# EAGLE design USBGpib (EAGLE 6.6.0)
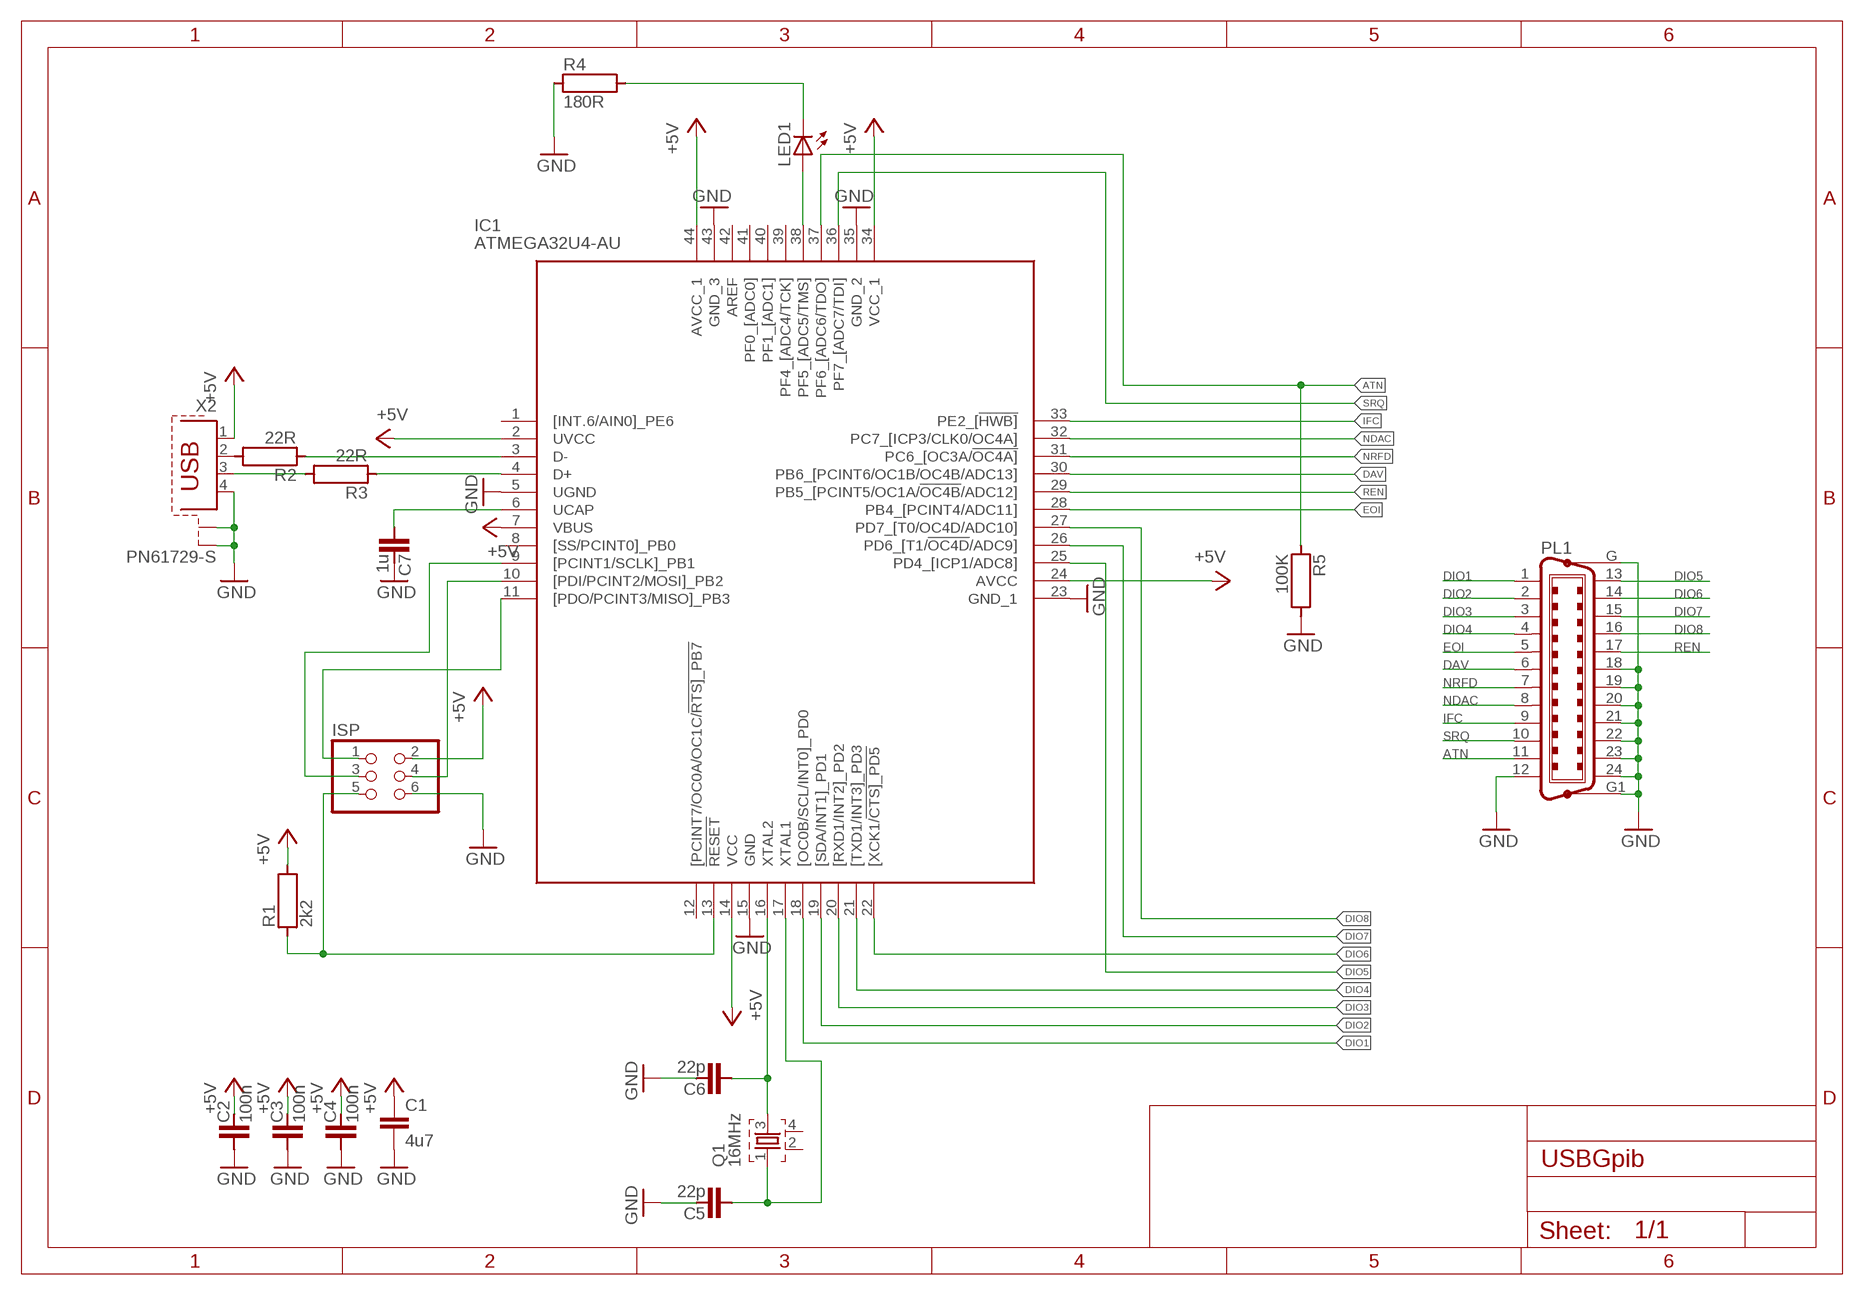
[diagram p0: schematic, sheet 1]

## Parts
C1  4u7  C-EUC1210  [C1210]
C2  100n  C0402  [C0402]
C3  100n  C0402  [C0402]
C4  100n  C0402  [C0402]
C5  22p  C0402  [C0402]
C6  22p  C0402  [C0402]
C7  1u  C0603  [C0603]
IC1  ATMEGA32U4-AU  ATMEGA16U4-AU  [QFP80P1200X1200X120-44N]
ISP  PINHD-2X3  [2X03]
LED1  LEDCHIPLED_1206  [CHIPLED_1206]
PL1  C24HPMALE  [24HP_MALE]
Q1  16MHz  FA-20H  [FA-20H]
R1  2k2  R0402  [R0402]
R2  22R  R0402  [R0402]
R3  22R  R0402  [R0402]
R4  180R  R0402  [R0402]
R5  100K  R0402  [R0402]
X2  PN61729-S  [PN61729-S]

## Nets
+5V: C1.1 C2.2 C3.2 C4.2 IC1.2(UVCC) IC1.7(VBUS) IC1.14(VCC) IC1.24(AVCC) IC1.34(VCC_1) IC1.44(AVCC_1) ISP.2 R1.2 X2.1
ATN: IC1.37(PF6_[ADC6/TDO]) PL1.11 R5.1
DAV: IC1.30(PB6_[PCINT6/OC1B/OC4B/ADC13]) PL1.6
DIO1: IC1.18([OC0B/SCL/INT0]_PD0) PL1.1
DIO2: IC1.19([SDA/INT1]_PD1) PL1.2
DIO3: IC1.20([RXD1/INT2]_PD2) PL1.3
DIO4: IC1.21([TXD1/INT3]_PD3) PL1.4
DIO5: IC1.25(PD4_[ICP1/ADC8]) PL1.13
DIO6: IC1.22([XCK1/!CTS]_PD5) PL1.14
DIO7: IC1.26(PD6_[T1/!OC4D!/ADC9]) PL1.15
DIO8: IC1.27(PD7_[T0/OC4D/ADC10]) PL1.16
EOI: IC1.28(PB4_[PCINT4/ADC11]) PL1.5
GND: C1.2 C2.1 C3.1 C4.1 C5.2 C6.2 C7.2 IC1.5(UGND) IC1.15(GND) IC1.23(GND_1) IC1.35(GND_2) IC1.43(GND_3) ISP.6 PL1.12 PL1.18 PL1.19 PL1.20 PL1.21 PL1.22 PL1.23 PL1.24 PL1.G PL1.G1 R4.1 R5.2 X2.4 X2.S1 X2.S2
IFC: IC1.33(PE2_[!HWB]) PL1.9
N$1: C6.1 IC1.16(XTAL2) Q1.3
N$2: C5.1 IC1.17(XTAL1) Q1.1
N$3: C7.1 IC1.6(UCAP)
N$4: R2.2 X2.2
N$5: IC1.3(D-) R2.1
N$6: IC1.4(D+) R3.1
N$7: R3.2 X2.3
N$8: IC1.13(!RESET) ISP.5 R1.1
N$9: LED1.C R4.2
N$10: IC1.10([PDI/PCINT2/MOSI]_PB2) ISP.4
N$11: IC1.9([PCINT1/SCLK]_PB1) ISP.3
N$12: IC1.11([PDO/PCINT3/MISO]_PB3) ISP.1
N$13: IC1.38(PF5_[ADC5/TMS]) LED1.A
NDAC: IC1.32(PC7_[ICP3/CLK0/OC4A]) PL1.8
NRFD: IC1.31(PC6_[OC3A/!OC4A]) PL1.7
REN: IC1.29(PB5_[PCINT5/OC1A/!OC4B!/ADC12]) PL1.17
SRQ: IC1.36(PF7_[ADC7/TDI]) PL1.10
Unconnected: IC1.1([INT.6/AIN0]_PE6) IC1.8([SS/PCINT0]_PB0) IC1.12([PCINT7/OC0A/OC1C/!RTS]_PB7) IC1.39(PF4_[ADC4/TCK]) IC1.40(PF1_[ADC1]) IC1.41(PF0_[ADC0]) IC1.42(AREF) Q1.2 Q1.4

## Library data of the parts
C1 = rcl:C-EU: CAPACITOR, European symbol
C2-C7 = KaiLib:C
IC1 = ATMEGA16U4-AU:ATMEGA16U4-AU: 8-bit Microcontrollers - MCU 16K Flsh, 1K EEPROM 2.5K SRAM Source: Datasheet <http://www.atmel.com/images/atmel-7766-8-bit-avr-atmega16u4-32u4_summary.pdf>; DESCRIPTION: 8-bit Microcontrollers - MCU 16K Flsh, 1K EEPROM 2.5K SRAM; HEIGHT: 1.2mm; MANUFACTURER_NAME: Microchip; MANUFACTURER_PART_NUMBER: ATMEGA16U4-AU; MOUSER_PART_NUMBER: 556-ATMEGA16U4-AU; MOUSER_PRICE-STOCK: https://www.mouser.com/Search/Refine.aspx?Keyword=556-ATMEGA16U4-AU; RS_PART_NUMBER: 1773649P; RS_PRICE-STOCK: http://uk.rs-online.com/web/p/products/1773649P
ISP = pinhead:PINHD-2X3: PIN HEADER
LED1 = led:LED: LED OSRAM: - CHIPLED LG R971, LG N971, LY N971, LG Q971, LY Q971, LO R971, LY R971 LH N974, LH R974 LS Q976, LO Q976, LY Q976 LO Q996 - Hyper CHIPLED LW Q18S LB Q993, LB Q99A, LB R99A - SideLED LS A670, LO A670, LY A670, LG A670, LP A670 LB A673, LV A673, LT A673, LW A673 LH A674 LY A675 LS A676, LA A676, LO A676, LY A676, LW A676 LS A679, LY A679, LG A679 - Hyper Micro SIDELED® LS Y876, LA Y876, LO Y876, LY Y876 LT Y87S - SmartLED LW L88C, LW L88S LB L89C, LB L89S, LG L890 LS L89K, LO L89K, LY L89K LS L896, LA L896, LO L896, LY L896 - TOPLED LS T670, LO T670, LY T670, LG T670, LP T670 LSG T670, LSP T670, LSY T670, LOP T670, LYG T670 LG T671, LOG T671, LSG T671 LB T673, LV T673, LT T673, LW T673 LH T674 LS T676, LA T676, LO T676, LY T676, LB T676, LH T676, LSB T676, LW T676 LB T67C, LV T67C, LT T67C, LS T67K, LO T67K, LY T67K, LW E67C LS E67B, LA E67B, LO E67B, LY E67B, LB E67C, LV E67C, LT E67C LW T67C LS T679, LY T679, LG T679 LS T770, LO T770, LY T770, LG T770, LP T770 LB T773, LV T773, LT T773, LW T773 LH T774 LS E675, LA E675, LY E675, LS T675 LS T776, LA T776, LO T776, LY T776, LB T776 LHGB T686 LT T68C, LB T68C - Hyper Mini TOPLED® LB M676 - Mini TOPLED Santana® LG M470 LS M47K, LO M47K, LY M47K Source: http://www.osram.convergy.de LUXEON: - LUMILED® LXK2-PW12-R00, LXK2-PW12-S00, LXK2-PW14-U00, LXK2-PW14-V00 LXK2-PM12-R00, LXK2-PM12-S00, LXK2-PM14-U00 LXK2-PE12-Q00, LXK2-PE12-R00, LXK2-PE12-S00, LXK2-PE14-T00, LXK2-PE14-U00 LXK2-PB12-K00, LXK2-PB12-L00, LXK2-PB12-M00, LXK2-PB14-N00, LXK2-PB14-P00, LXK2-PB14-Q00 LXK2-PR12-L00, LXK2-PR12-M00, LXK2-PR14-Q00, LXK2-PR14-R00 LXK2-PD12-Q00, LXK2-PD12-R00, LXK2-PD12-S00 LXK2-PH12-R00, LXK2-PH12-S00 LXK2-PL12-P00, LXK2-PL12-Q00, LXK2-PL12-R00 Source: www.luxeon.com KINGBRIGHT: KA-3528ASYC Source: www.kingbright.com
PL1 = con-amp-champ:C24HP: CONNECTOR
Q1 = crystal:FA-: MHz RANGE CRYSTAL UNIT Source: Epson Toyocom
R1-R5 = KaiLib:R
X2 = con-berg:PN61729-S: BERG USB connector; OC_FARNELL: unknown; OC_NEWARK: unknown

## Board
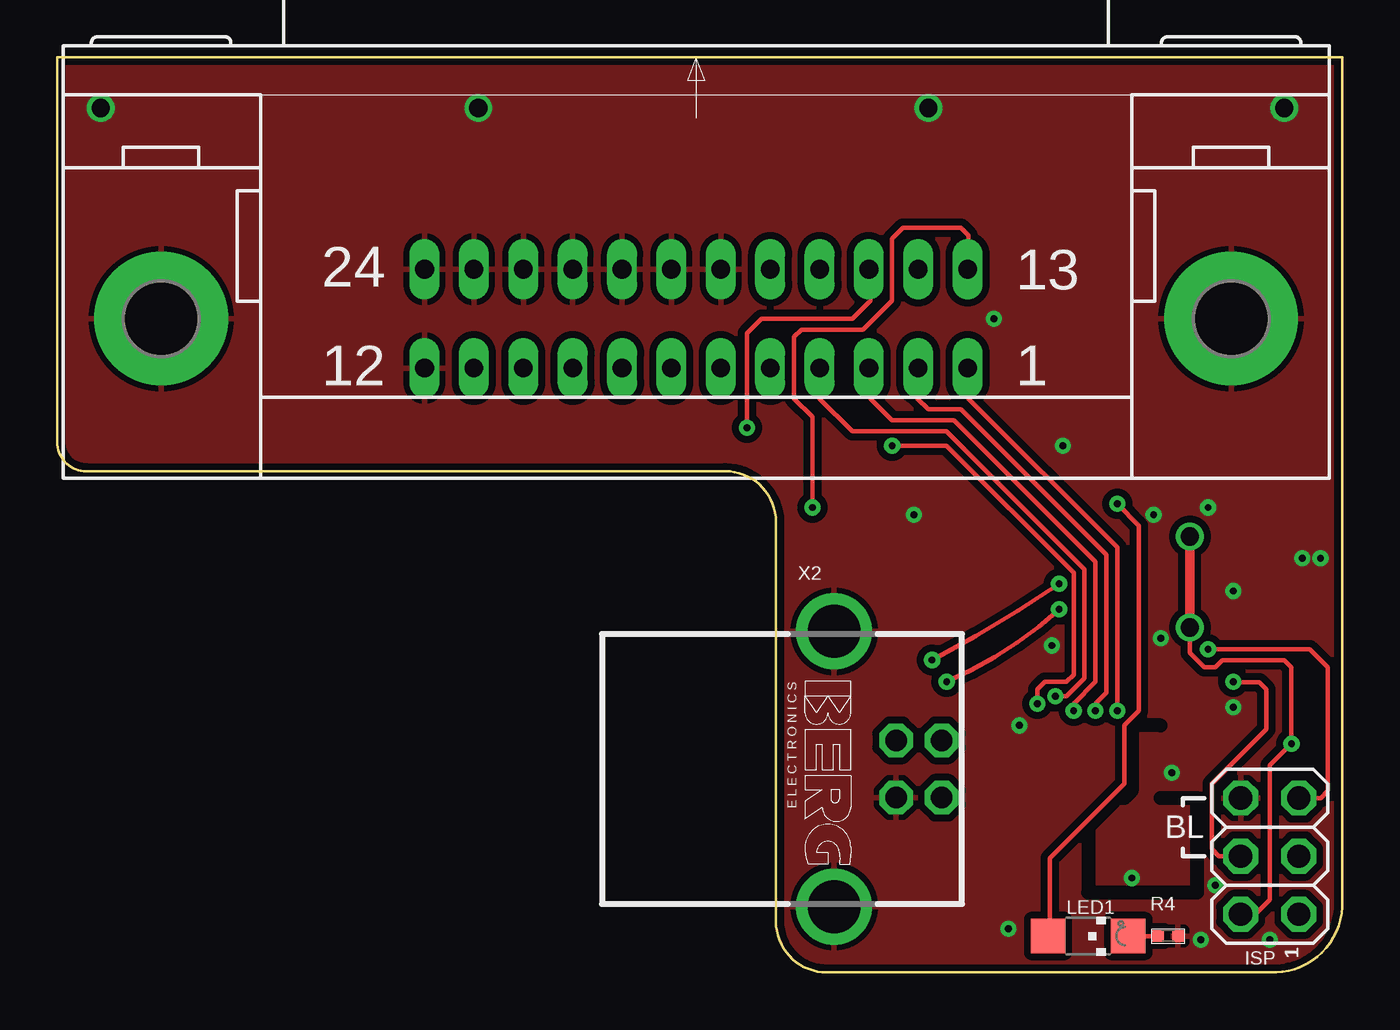
[diagram p1: board, top side]
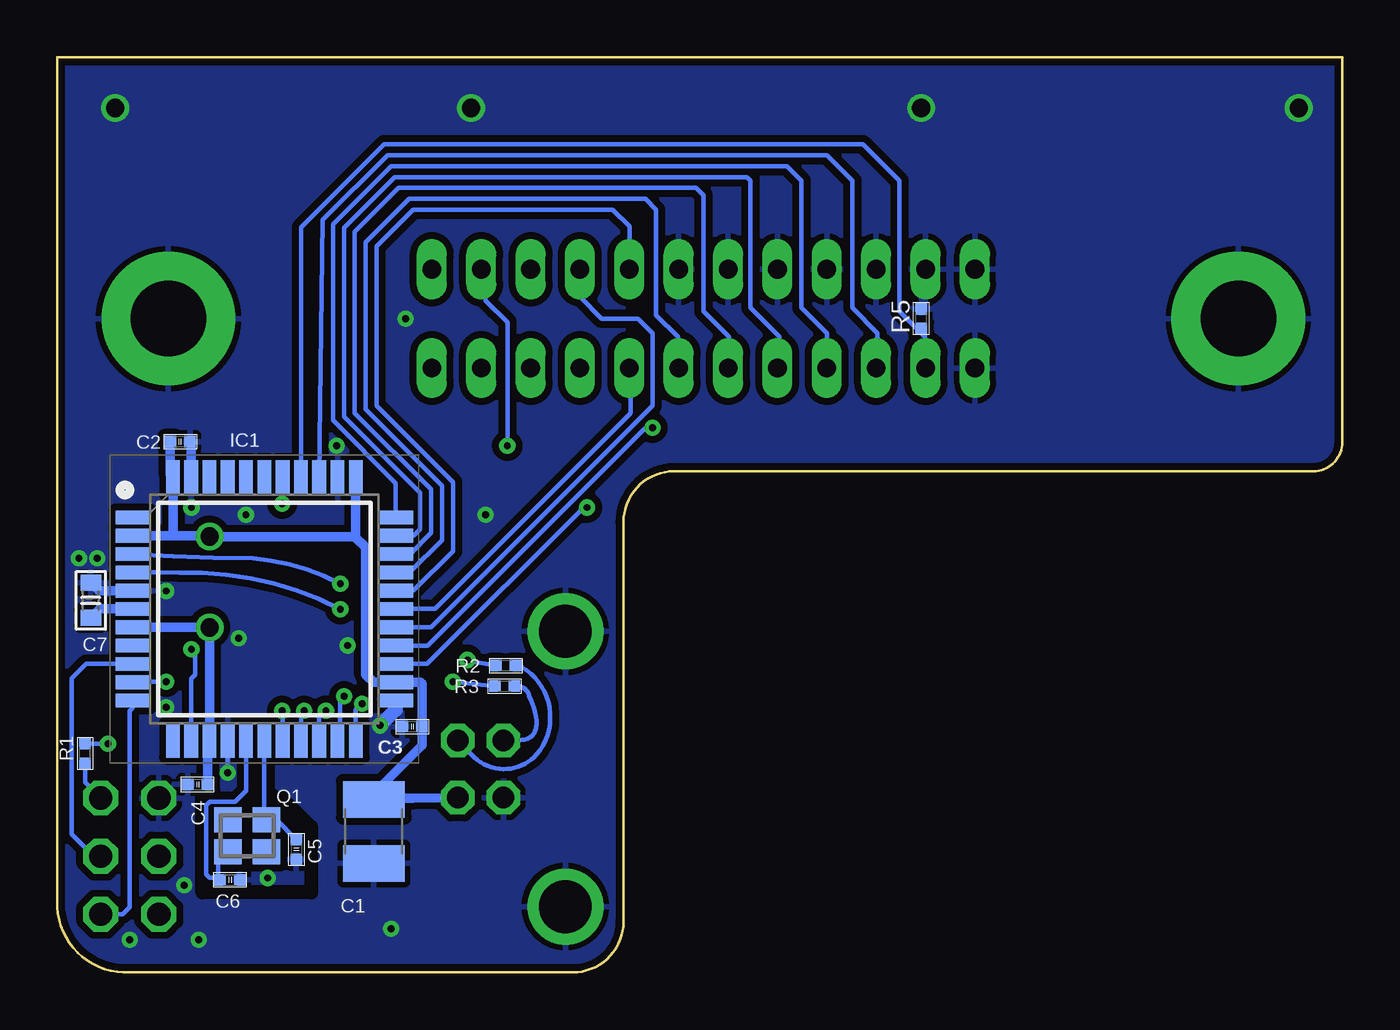
[diagram p2: board, bottom side, seen from below]

Size 56.2 x 40.01 mm. Coordinates in mm from the lower left corner, seen from the top.
Outline: 56.2,40.01 0,40.01 0,23.18 arc90 1.27,21.91 29.21,21.91 arc-90 31.43,19.69 31.43,2.22 arc90 33.66,0 53.02,0 arc90 56.2,2.86 56.2,40.01
Copper layers (1*16): Top 0.035mm / dielectric 1.5mm / Bottom 0.035mm
Design rules "default *": minimum track width 5.5mil, minimum drill 0.25mm, track to track 5.5mil, track to pad 5.5mil, pad to pad 5.5mil, via to via 5.5mil, smd to smd 0mil, copper to edge 0.01mm, drill to drill 5.5mil, minimum pad ring 10mil, minimum via ring 8mil, stop-mask expansion 4mil, vias tented up to drill 0.85mm, thermal gap 10mil
tRestrict: 9 lines
bRestrict: 9 lines

### Footprints (pad centres in the part's own frame; a part is rotated, then mirrored left to right if it is on the bottom)
C1210 = smd 1.6 x 2.7: 1 -1.4,0; 2 1.4,0
C0402 = smd 0.508 x 0.508: 1 -0.432,0; 2 0.432,0
C0603 = smd 0.7 x 0.9: 1 -0.762,0; 2 0.762,0
QFP80P1200X1200X120-44N = smd 1.5 x 0.6: 1 -5.75,4; 2 -5.75,3.2; 3 -5.75,2.4; 4 -5.75,1.6; 5 -5.75,0.8; 6 -5.75,0; 7 -5.75,-0.8; 8 -5.75,-1.6; 9 -5.75,-2.4; 10 -5.75,-3.2; 11 -5.75,-4; 23 5.75,-4; 24 5.75,-3.2; 25 5.75,-2.4; 26 5.75,-1.6; 27 5.75,-0.8; 28 5.75,0; 29 5.75,0.8; 30 5.75,1.6; 31 5.75,2.4; 32 5.75,3.2; 33 5.75,4 | smd 0.6 x 1.5: 12 -4,-5.75; 13 -3.2,-5.75; 14 -2.4,-5.75; 15 -1.6,-5.75; 16 -0.8,-5.75; 17 0,-5.75; 18 0.8,-5.75; 19 1.6,-5.75; 20 2.4,-5.75; 21 3.2,-5.75; 22 4,-5.75; 34 4,5.75; 35 3.2,5.75; 36 2.4,5.75; 37 1.6,5.75; 38 0.8,5.75; 39 0,5.75; 40 -0.8,5.75; 41 -1.6,5.75; 42 -2.4,5.75; 43 -3.2,5.75; 44 -4,5.75
2X03 = drill 1.016 octagon: 1 -2.54,-1.27; 2 -2.54,1.27; 3 0,-1.27; 4 0,1.27; 5 2.54,-1.27; 6 2.54,1.27
CHIPLED_1206 = smd 1.5 x 1.5: A 0,-1.75; C 0,1.75
24HP_MALE = drill 0.813 long: 1 11.874,-2.159; 2 9.716,-2.159; 3 7.556,-2.159; 4 5.397,-2.159; 5 3.239,-2.159; 6 1.079,-2.159; 7 -1.079,-2.159; 8 -3.239,-2.159; 9 -5.397,-2.159; 10 -7.556,-2.159; 11 -9.716,-2.159; 12 -11.874,-2.159; 13 11.874,2.159; 14 9.716,2.159; 15 7.556,2.159; 16 5.397,2.159; 17 3.239,2.159; 18 1.079,2.159; 19 -1.079,2.159; 20 -3.239,2.159; 21 -5.397,2.159; 22 -7.556,2.159; 23 -9.716,2.159; 24 -11.874,2.159 | drill 3.302 pad 5.842: G -23.393,0; G1 23.393,0
FA-20H = smd 1.2 x 1.1: 1 -0.85,-0.7; 2 0.85,-0.7; 3 0.85,0.7; 4 -0.85,0.7
R0402 = smd 0.508 x 0.508: 1 -0.432,0; 2 0.432,0
PN61729-S = drill 0.95 octagon: 1 1.25,4.71; 2 -1.25,4.71; 3 -1.25,2.71; 4 1.25,2.71 | drill 2.3 pad 2.9: S1 -6.02,0; S2 6.02,0

### Placement (x,y rotation side)
C1  42.35,6.17 270 bottom
C2  50.82,23.2 180 bottom
C3  40.68,10.75 0 bottom
C4  50.06,8.21 0 bottom
C5  45.74,5.37 270 bottom
C6  48.64,4.04 0 bottom
C7  54.73,16.26 90 bottom
IC1  47.14,15.89 0 bottom
ISP  53.02,5.08 90 top
LED1  45.08,1.59 270 top
PL1  27.94,28.58 0 top
Q1  47.89,5.97 180 bottom
R1  54.97,9.57 90 bottom
R2  36.58,13.41 0 bottom
R3  36.63,12.51 0 bottom
R4  48.58,1.59 180 top
R5  18.41,28.58 90 bottom
X2  33.97,8.89 270 top

### Tracks (layer width: path | path; a pad name or v marks a point on that pad's centre or on a via)
+5V  (via drill 0.3, 0.8)
  Top 0.2: ISP.2 52.39,2.54 53.02,3.18 53.02,9.05 v53.97,10 53.97,13.34 53.66,13.65 50.96,13.65 50.64,13.34 50.16,13.34 49.53,13.97 v49.53,15.08
  Top 0.406: v49.53,15.08 v49.53,19.05
  Bottom 0.2: v53.97,10 R1.2
  Bottom 0.406: C4.2 49.62,10.05 IC1.14 v49.53,15.08 v49.53,15.09 IC1.7 | C2.2 51.25,21.75 IC1.44 51.12,21.64 51.12,19.09 | IC1.2 51.12,19.09 | 51.12,19.09 49.53,19.09 v49.53,19.05 43.18,19.05 | IC1.34 43.14,19.09 43.18,19.05 | 43.18,19.05 42.7,18.58 42.7,13.02 42.37,12.69 IC1.24 40.31,12.69 40.24,12.62 C3.2 40.24,9.92 42.23,7.94 42.23,7.69 C1.1 42.3,7.62 40.64,7.62 39.03,7.64 X2.1
ATN
  Bottom 0.2: IC1.37 45.54,32.57 41.91,36.2 20.95,36.2 19.37,34.61 19.37,28.89 18.26,27.78 | 18.26,27.78 18.26,26.99 18.26,26.45 PL1.11 | R5.1 18.26,27.99 18.26,27.78
DAV
  Bottom 0.2: IC1.30 40.78,17.49 39.37,18.89 39.37,21.27 42.7,24.61 42.7,31.91 40.8,33.82 30.48,33.82 30,33.34 30,28.74 29.05,27.78 29.05,26.45 PL1.6
DIO1  (via drill 0.3)
  Top 0.2: v46.35,11.43 46.35,18.58 39.85,25.08 39.85,26.39 PL1.1
  Bottom 0.2: IC1.18 46.34,11.42 v46.35,11.43
DIO2  (via drill 0.3)
  Top 0.2: v45.4,11.43 45.4,11.75 45.88,12.23 45.88,18.26 39.53,24.61 38.1,24.61 37.62,25.08 37.62,26.39 PL1.2
  Bottom 0.2: IC1.19 45.54,11.3 v45.4,11.43
DIO3  (via drill 0.3)
  Top 0.2: v44.45,11.43 44.45,11.75 45.4,12.7 45.4,17.94 39.21,24.13 36.51,24.13 35.56,25.08 35.56,26.35 PL1.3
  Bottom 0.2: IC1.20 44.74,11.14 v44.45,11.43
DIO4  (via drill 0.3)
  Top 0.2: v43.66,12.07 44.13,12.07 44.93,12.86 44.93,17.62 38.89,23.66 34.77,23.66 33.34,25.08 PL1.4
  Bottom 0.2: IC1.21 43.94,10.67 43.81,10.8 43.81,11.91 v43.66,12.07
DIO5  (via drill 0.3)
  Top 0.2: v33.02,20.32 33.02,24.29 32.23,25.08 32.23,27.78 32.54,28.1 35.24,28.1 36.51,29.37 36.51,32.07 36.99,32.55 39.53,32.55 39.85,32.23 39.85,30.77 PL1.13
  Bottom 0.2: IC1.25 40.01,13.49 33.18,20.32 v33.02,20.32
DIO6  (via drill 0.3)
  Top 0.2: v42.86,11.75 42.86,12.38 43.18,12.7 44.13,12.7 44.45,13.02 44.45,17.46 38.89,23.02 v36.51,23.02
  Bottom 0.2: IC1.22 43.14,11.47 v42.86,11.75 | v36.51,23.02 36.51,28.42 37.47,29.37 37.47,30.55 PL1.14
DIO7  (via drill 0.3)
  Top 0.2: v30.16,23.81 30.16,27.94 30.8,28.58 34.77,28.58 35.56,29.37 35.56,30.67 PL1.15
  Bottom 0.2: IC1.26 40.01,14.29 30.48,23.81 v30.16,23.81
DIO8
  Bottom 0.2: IC1.27 39.84,15.09 30.16,24.77 30.16,27.94 30.8,28.58 32.38,28.58 33.34,29.53 PL1.16
EOI
  Bottom 0.2: IC1.28 39.68,15.89 31.11,24.45 31.11,26.35 PL1.5
GND  (via drill 0.3, 0.8)
  Bottom 0.2: IC1.15 48.74,9.05 v48.74,8.73 48.74,9.05
  Bottom 0.406: IC1.5 54.39,16.69 C7.2 | C2.1 50.32,23.13 50.34,23.12 IC1.43
  Bottom 0.61: IC1.23 41.39,11.48 v42.07,10.8
  other vias: 1.91,37.78 18.41,37.78 38.1,37.78 53.66,37.78 46.99,4.13 47.94,20 48.26,14.61 43.5,14.29 51.44,16.67 43.97,23.02 54.45,18.1 55.24,18.1 51.44,11.59 37.47,20 50.32,20.32 50.01,1.43 50.64,3.81 53.02,1.43 41.59,1.91 40.96,28.58
  pour Bottom (isolate 0.305): 0,40.01 56.2,40.01 56.2,2.86 arc-90 53.34,0 33.66,0 arc-90 31.43,2.22 31.43,19.69 arc90 29.21,21.91 1.27,21.91 arc-90 0,23.18
  pour Top (isolate 0.305): 0,40.01 56.2,40.01 56.2,2.86 arc-90 53.34,0 33.66,0 arc-90 31.43,2.22 31.43,19.69 arc90 29.21,21.91 1.27,21.91 arc-90 0,23.18
IFC
  Bottom 0.2: IC1.33 41.39,21.39 44.13,24.13 44.13,32.7 41.59,35.24 24.29,35.24 23.65,34.61 23.65,29.05 22.54,27.94 PL1.9
N$1
  Bottom 0.2: IC1.16 47.94,7.94 48.42,7.46 49.53,7.46 49.69,7.3 49.69,4.29 49.53,4.13 49.16,4.13 | 49.16,4.13 C6.1 | 49.16,4.13 49.16,4.85 Q1.3
N$2
  Bottom 0.2: IC1.17 47.14,6.77 Q1.1 46.6,6.67 C5.1
N$3
  Bottom 0.406: IC1.6 54.34,15.89 C7.1
N$4
  Bottom 0.2: X2.2 38.1,9.53 arc-45 36.67,8.89 arc-51 35.24,9.53 arc-100 35.88,13.34 arc-54 R2.2
N$5  (via drill 0.3)
  Top 0.2: v38.26,13.65 arc6 v43.81,16.99
  Bottom 0.2: R2.1 37.47,13.5 arc7 v38.26,13.65 | v43.81,16.99 arc-23 47.62,18.1 arc3 IC1.3
N$6  (via drill 0.3)
  Top 0.2: v38.89,12.7 arc19 v43.81,15.88
  Bottom 0.2: R3.1 v38.89,12.7 | v43.81,15.88 arc-26 49.85,17.46 arc-2 IC1.4
N$7
  Bottom 0.2: X2.3 35.88,10.16 arc-87 35.24,10.8 arc-31 35.56,12.07 arc-90 R3.2
N$8  (via drill 0.3)
  Top 0.2: v50.32,14.13 54.77,14.13 55.56,13.34 55.56,7.94 55.24,7.62 ISP.5
  Bottom 0.2: IC1.13 50.34,12.85 50.16,13.02 50.16,13.97 v50.32,14.13 | R1.1 54.97,8.3 ISP.5
N$9
  Top 0.2: R4.2 LED1.C
N$10  (via drill 0.3)
  Top 0.2: v51.44,12.7 51.45,12.69 52.57,12.69 52.7,12.55 52.86,12.38 52.86,10.64 50.48,8.26 50.48,5.4 50.8,5.08 ISP.4
  Bottom 0.2: v51.44,12.7 52.87,12.7 IC1.10
N$11
  Bottom 0.2: ISP.3 54.61,5.08 55.56,6.03 55.56,12.86 54.93,13.5 IC1.9
N$12
  Bottom 0.2: IC1.11 52.89,11.57 53.02,11.43 53.02,2.86 53.34,2.54 ISP.1
N$13  (via drill 0.3)
  Top 0.2: LED1.A 43.4,1.59 | 43.5,1.59 43.4,1.59 | 43.4,1.59 43.4,4.98 46.67,8.26 46.67,10.8 47.31,11.43 47.31,19.53 v46.35,20.48
  Bottom 0.2: v46.35,20.48 46.35,21.62 IC1.38
NDAC
  Bottom 0.2: IC1.32 40.61,19.09 40.32,19.37 40.32,20.96 43.66,24.29 43.66,32.55 41.43,34.77 26.03,34.77 25.88,34.61 25.88,29.05 24.61,27.78 24.61,26.51 PL1.8
NRFD
  Bottom 0.2: IC1.31 40.77,18.29 39.85,19.21 39.85,21.12 43.18,24.45 43.18,32.39 41.27,34.29 28.26,34.29 27.94,33.97 27.94,28.89 26.83,27.78 26.83,26.45 PL1.7
REN
  Bottom 0.2: IC1.29 40.62,16.69 38.89,18.42 38.89,21.43 42.23,24.77 42.23,31.75 40.64,33.34 31.91,33.34 31.18,32.61 PL1.17
SRQ
  Bottom 0.2: IC1.36 44.58,32.89 41.75,35.72 22.54,35.72 21.43,34.61 21.43,29.05 20.32,27.94 20.32,26.48 PL1.10

### Text on the board
tPlace: 1
tNames: BL